# EAGLE design PygmyETEX_v1p00 (EAGLE 5.11)

## Sheet 1 of 5
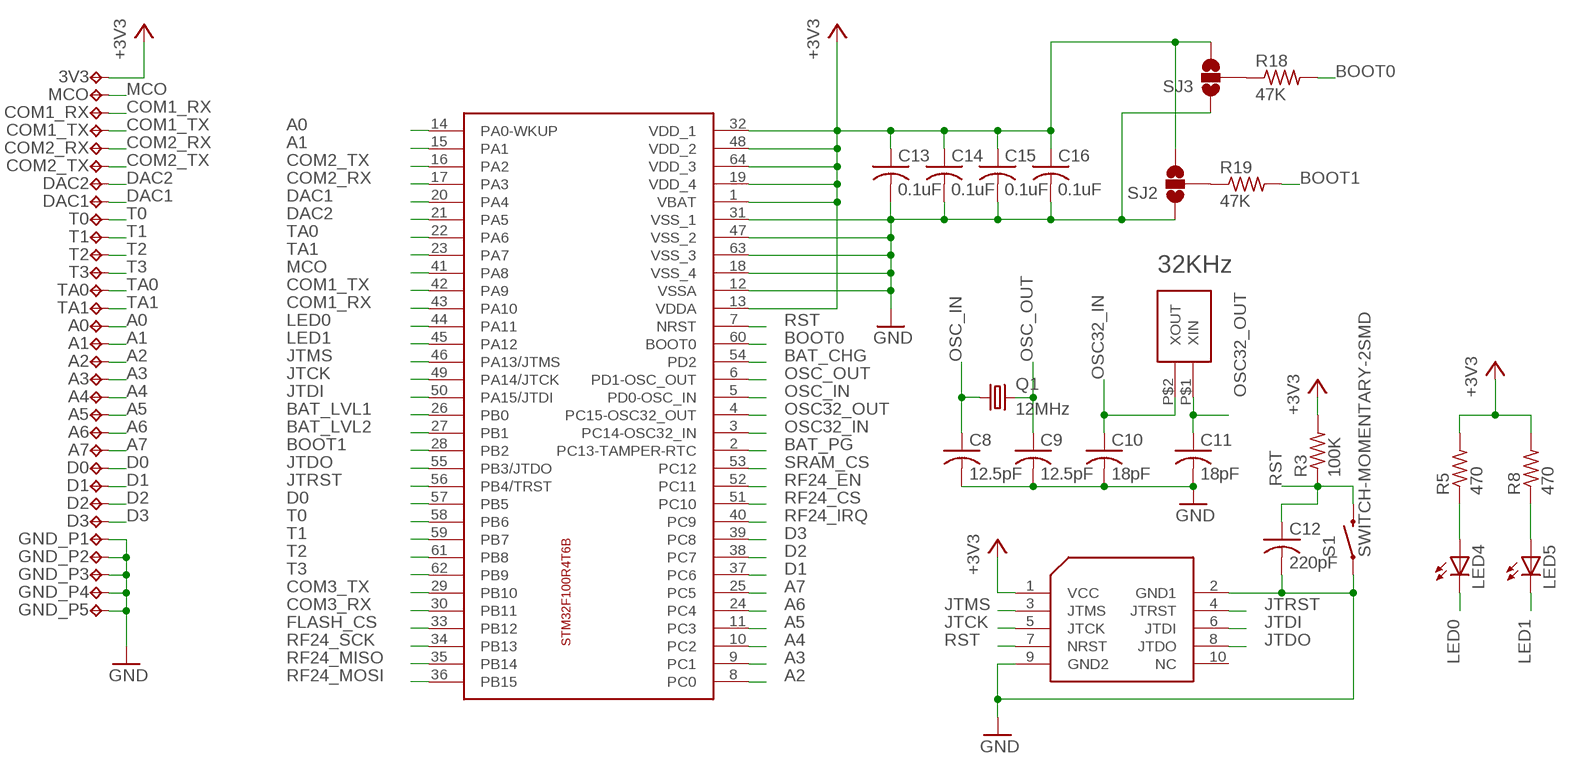
[diagram p0: schematic, sheet 1]

### Parts
3V3  TESTPAD_TPTESTPAD_PTH_STD  [TESTPAD_PTH_STD]
A0  TESTPAD_TPTESTPAD_PTH_STD  [TESTPAD_PTH_STD]
A1  TESTPAD_TPTESTPAD_PTH_STD  [TESTPAD_PTH_STD]
A2  TESTPAD_TPTESTPAD_PTH_STD  [TESTPAD_PTH_STD]
A3  TESTPAD_TPTESTPAD_PTH_STD  [TESTPAD_PTH_STD]
A4  TESTPAD_TPTESTPAD_PTH_STD  [TESTPAD_PTH_STD]
A5  TESTPAD_TPTESTPAD_PTH_STD  [TESTPAD_PTH_STD]
A6  TESTPAD_TPTESTPAD_PTH_STD  [TESTPAD_PTH_STD]
A7  TESTPAD_TPTESTPAD_PTH_STD  [TESTPAD_PTH_STD]
C8  12.5pF  C-USC0402  [C0402]
C9  12.5pF  C-USC0402  [C0402]
C10  18pF  C-USC0402  [C0402]
C11  18pF  C-USC0402  [C0402]
C12  220pF  C-USC0402  [C0402]
C13  0.1uF  C-USC0402  [C0402]
C14  0.1uF  C-USC0402  [C0402]
C15  0.1uF  C-USC0402  [C0402]
C16  0.1uF  C-USC0402  [C0402]
COM1_RX  TESTPAD_TPTESTPAD_PTH_STD  [TESTPAD_PTH_STD]
COM1_TX  TESTPAD_TPTESTPAD_PTH_STD  [TESTPAD_PTH_STD]
COM2_RX  TESTPAD_TPTESTPAD_PTH_STD  [TESTPAD_PTH_STD]
COM2_TX  TESTPAD_TPTESTPAD_PTH_STD  [TESTPAD_PTH_STD]
D0  TESTPAD_TPTESTPAD_PTH_STD  [TESTPAD_PTH_STD]
D1  TESTPAD_TPTESTPAD_PTH_STD  [TESTPAD_PTH_STD]
D2  TESTPAD_TPTESTPAD_PTH_STD  [TESTPAD_PTH_STD]
D3  TESTPAD_TPTESTPAD_PTH_STD  [TESTPAD_PTH_STD]
DAC1  TESTPAD_TPTESTPAD_PTH_STD  [TESTPAD_PTH_STD]
DAC2  TESTPAD_TPTESTPAD_PTH_STD  [TESTPAD_PTH_STD]
GND_P1  TESTPAD_TPTESTPAD_PTH_STD  [TESTPAD_PTH_STD]
GND_P2  TESTPAD_TPTESTPAD_PTH_STD  [TESTPAD_PTH_STD]
GND_P3  TESTPAD_TPTESTPAD_PTH_STD  [TESTPAD_PTH_STD]
GND_P4  TESTPAD_TPTESTPAD_PTH_STD  [TESTPAD_PTH_STD]
GND_P5  TESTPAD_TPTESTPAD_PTH_STD  [TESTPAD_PTH_STD]
LED4  LED0603  [LED-0603]
LED5  LED0603  [LED-0603]
MCO  TESTPAD_TPTESTPAD_PTH_STD  [TESTPAD_PTH_STD]
Q1  12MHz  CRYSTAL5X3  [CRYSTAL-SMD-5X3]
Q2  CM415  [CM415]
R3  100K  R-US_R0402  [R0402]
R5  470  R-US_R0402  [R0402]
R8  470  R-US_R0402  [R0402]
R18  47K  R-US_R0402  [R0402]
R19  47K  R-US_R0402  [R0402]
S1  SWITCH-MOMENTARY-2SMD  [TACTILE_SWITCH_SMD]
SJ2  SOLDERJUMPER_2WAYPASTE1&2  [SJ_3_PASTE1&2]
SJ3  SOLDERJUMPER_2WAYPASTE1&2  [SJ_3_PASTE1&2]
T0  TESTPAD_TPTESTPAD_PTH_STD  [TESTPAD_PTH_STD]
T1  TESTPAD_TPTESTPAD_PTH_STD  [TESTPAD_PTH_STD]
T2  TESTPAD_TPTESTPAD_PTH_STD  [TESTPAD_PTH_STD]
T3  TESTPAD_TPTESTPAD_PTH_STD  [TESTPAD_PTH_STD]
TA0  TESTPAD_TPTESTPAD_PTH_STD  [TESTPAD_PTH_STD]
TA1  TESTPAD_TPTESTPAD_PTH_STD  [TESTPAD_PTH_STD]
U3  STM32F100R4T6B  [S-PQFP64-G64]
U$1  STM32-JTAG-10P  [STM32-JTAG-10P]

### Nets
+3V3: 3V3.P$1(TP) C13.1 C14.1 C15.1 C16.1 R3.2 R5.2 R8.2 SJ2.3 SJ3.3 U3.1(VBAT) U3.13(VDDA) U3.19(VDD_4) U3.32(VDD_1) U3.48(VDD_2) U3.64(VDD_3) U$1.1(VCC) ; also sheet 2,3,5
A0: A0.P$1(TP) U3.14(PA0-WKUP)
A1: A1.P$1(TP) U3.15(PA1)
A2: A2.P$1(TP) U3.8(PC0)
A3: A3.P$1(TP) U3.9(PC1)
A4: A4.P$1(TP) U3.10(PC2)
A5: A5.P$1(TP) U3.11(PC3)
A6: A6.P$1(TP) U3.24(PC4)
A7: A7.P$1(TP) U3.25(PC5)
BAT_CHG: U3.54(PD2) ; also sheet 3
BAT_LVL1: U3.26(PB0) ; also sheet 3
BAT_LVL2: U3.27(PB1) ; also sheet 3
BAT_PG: U3.2(PC13-TAMPER-RTC) ; also sheet 3
BOOT0: R18.2 U3.60(BOOT0)
BOOT1: R19.2 U3.28(PB2)
COM1_RX: COM1_RX.P$1(TP) U3.43(PA10)
COM1_TX: COM1_TX.P$1(TP) U3.42(PA9)
COM2_RX: COM2_RX.P$1(TP) U3.17(PA3)
COM2_TX: COM2_TX.P$1(TP) U3.16(PA2)
COM3_RX: U3.30(PB11) ; also sheet 4
COM3_TX: U3.29(PB10) ; also sheet 4
D0: D0.P$1(TP) U3.57(PB5)
D1: D1.P$1(TP) U3.37(PC6)
D2: D2.P$1(TP) U3.38(PC7)
D3: D3.P$1(TP) U3.39(PC8)
DAC1: DAC1.P$1(TP) U3.20(PA4)
DAC2: DAC2.P$1(TP) U3.21(PA5)
FLASH_CS: U3.33(PB12) ; also sheet 5
GND: C8.2 C9.2 C10.2 C11.2 C12.2 C13.2 C14.2 C15.2 C16.2 GND_P1.P$1(TP) GND_P2.P$1(TP) GND_P3.P$1(TP) GND_P4.P$1(TP) GND_P5.P$1(TP) S1.1 SJ2.1 SJ3.1 U3.12(VSSA) U3.18(VSS_4) U3.31(VSS_1) U3.47(VSS_2) U3.63(VSS_3) U$1.2(GND1) U$1.9(GND2) ; also sheet 2,3,4,5
JTCK: U3.49(PA14/JTCK) U$1.5(JTCK)
JTDI: U3.50(PA15/JTDI) U$1.6(JTDI)
JTDO: U3.55(PB3/JTDO) U$1.8(JTDO)
JTMS: U3.46(PA13/JTMS) U$1.3(JTMS)
JTRST: U3.56(PB4/TRST) U$1.4(JTRST)
LED0: LED4.C U3.44(PA11)
LED1: LED5.C U3.45(PA12)
MCO: MCO.P$1(TP) U3.41(PA8)
N$23: LED4.A R5.1
N$29: LED5.A R8.1
N$31: R18.1 SJ3.2
N$33: R19.1 SJ2.2
OSC32_IN: C10.1 Q2.P$2(XOUT) U3.3(PC14-OSC32_IN)
OSC32_OUT: C11.1 Q2.P$1(XIN) U3.4(PC15-OSC32_OUT)
OSC_IN: C8.1 Q1.1 U3.5(PD0-OSC_IN)
OSC_OUT: C9.1 Q1.3 U3.6(PD1-OSC_OUT)
RF24_CS: U3.51(PC10) ; also sheet 2
RF24_EN: U3.52(PC11) ; also sheet 2
RF24_IRQ: U3.40(PC9) ; also sheet 2
RF24_MISO: U3.35(PB14) ; also sheet 2,5
RF24_MOSI: U3.36(PB15) ; also sheet 2,5
RF24_SCK: U3.34(PB13) ; also sheet 2,5
RST: C12.1 R3.1 S1.3 U3.7(NRST) U$1.7(NRST)
SRAM_CS: U3.53(PC12) ; also sheet 5
T0: T0.P$1(TP) U3.58(PB6)
T1: T1.P$1(TP) U3.59(PB7)
T2: T2.P$1(TP) U3.61(PB8)
T3: T3.P$1(TP) U3.62(PB9)
TA0: TA0.P$1(TP) U3.22(PA6)
TA1: TA1.P$1(TP) U3.23(PA7)
Unconnected: U$1.10(NC)

## Sheet 2 of 5
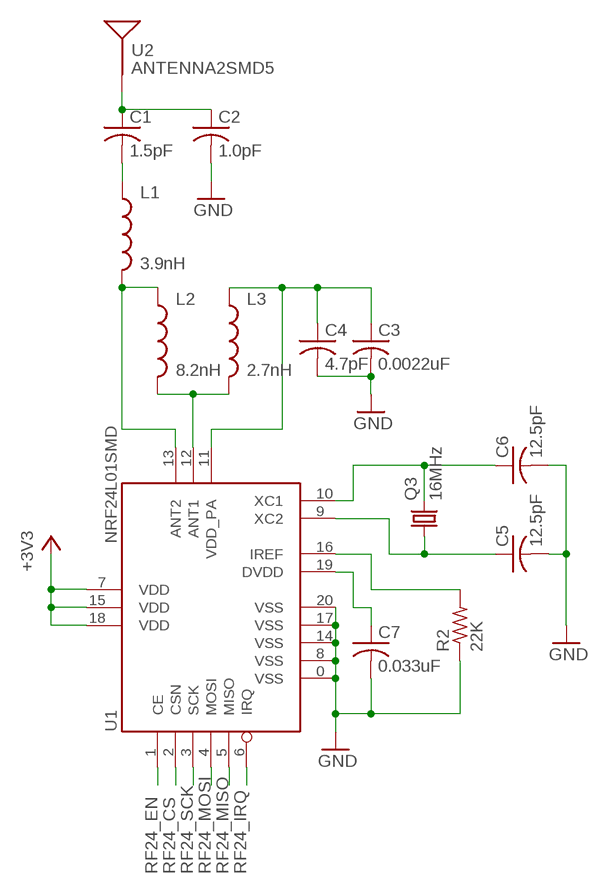
[diagram p1: schematic, sheet 2]

### Parts
C1  1.5pF  C-USC0402  [C0402]
C2  1.0pF  C-USC0402  [C0402]
C3  0.0022uF  C-USC0402  [C0402]
C4  4.7pF  C-USC0402  [C0402]
C5  12.5pF  C-USC0402  [C0402]
C6  12.5pF  C-USC0402  [C0402]
C7  0.033uF  C-USC0402  [C0402]
L1  3.9nH  INDUCTOR0402  [C0402]
L2  8.2nH  INDUCTOR0402  [C0402]
L3  2.7nH  INDUCTOR0402  [C0402]
Q3  16MHz  CRYSTAL5X3  [CRYSTAL-SMD-5X3]
R2  22K  R-US_R0402  [R0402]
U1  NRF24L01SMD  [QFN20]
U2  ANTENNA2SMD5  [ANTENNA-CHIP5]

### Nets
+3V3: U1.7(VDD) U1.15(VDD) U1.18(VDD) ; also sheet 1,3,5
GND: C2.2 C3.2 C4.2 C5.2 C6.2 C7.2 R2.1 U1.0(VSS) U1.8(VSS) U1.14(VSS) U1.17(VSS) U1.20(VSS) ; also sheet 1,3,4,5
N$1: C1.1 C2.1 U2.FEED(SIGNAL)
N$2: C1.2 L1.1
N$3: L1.2 L2.1 U1.13(ANT2)
N$4: L2.2 L3.2 U1.12(ANT1)
N$5: C3.1 C4.1 L3.1 U1.11(VDD_PA)
N$7: C6.1 Q3.3 U1.10(XC1)
N$8: C5.1 Q3.1 U1.9(XC2)
N$10: R2.2 U1.16(IREF)
N$11: C7.1 U1.19(DVDD)
RF24_CS: U1.2(CSN) ; also sheet 1
RF24_EN: U1.1(CE) ; also sheet 1
RF24_IRQ: U1.6(IRQ) ; also sheet 1
RF24_MISO: U1.5(MISO) ; also sheet 1,5
RF24_MOSI: U1.4(MOSI) ; also sheet 1,5
RF24_SCK: U1.3(SCK) ; also sheet 1,5

## Sheet 3 of 5
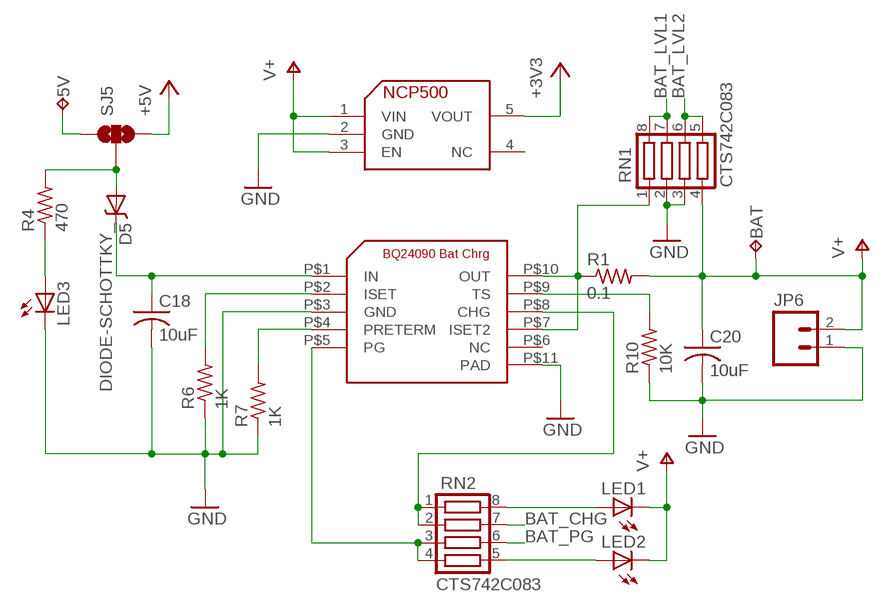
[diagram p2: schematic, sheet 3]

### Parts
5V  TESTPAD_TPTESTPAD_PTH_STD  [TESTPAD_PTH_STD]
BAT  TESTPAD_TPTESTPAD_PTH_STD  [TESTPAD_PTH_STD]
C18  10uF  C-USC1206  [C1206]
C20  10uF  C-USC1206  [C1206]
D5  DIODE-SCHOTTKY_  [SMA-DIODE]
JP6  M02-JST-2MM-SMT  [JST-2-SMD]
LED1  LED0603  [LED-0603]
LED2  LED0603  [LED-0603]
LED3  LED0603  [LED-0603]
R1  0.1  R-US_R0805  [R0805]
R4  470  R-US_R0402  [R0402]
R6  1K  R-US_R0402  [R0402]
R7  1K  R-US_R0402  [R0402]
R10  10K  R-US_R0402  [R0402]
RN1  CTS742C083  [CTS742C083]
RN2  CTS742C083  [CTS742C083]
SJ5  SOLDERJUMPER_2WAYPASTE1&2  [SJ_3_PASTE1&2]
U6  BQ24090  [R-PDSO-G10]
U8  NCP500  [SOT23-5L]

### Nets
+3V3: U8.5(VOUT) ; also sheet 1,2,5
+5V: SJ5.3 ; also sheet 4
BAT_CHG: RN2.7 ; also sheet 1
BAT_LVL1: RN1.7 RN1.8 ; also sheet 1
BAT_LVL2: RN1.5 RN1.6 ; also sheet 1
BAT_PG: RN2.6 ; also sheet 1
GND: C18.2 C20.2 JP6.1 LED3.C R6.1 R7.1 R10.1 RN1.2 RN1.3 U6.P$3(GND) U6.P$11(PAD) U8.2(GND) ; also sheet 1,2,4,5
N$6: C18.1 D5.C U6.P$1(IN)
N$9: 5V.P$1(TP) SJ5.1
N$12: R6.2 U6.P$2(ISET)
N$13: R7.2 U6.P$4(PRETERM)
N$14: RN2.3 RN2.4 U6.P$5(PG)
N$15: LED3.A R4.1
N$16: R1.1 RN1.1 U6.P$7(ISET2) U6.P$10(OUT)
N$17: RN2.1 RN2.2 U6.P$8(CHG)
N$18: R10.2 U6.P$9(TS)
N$20: LED1.A RN2.8
N$25: D5.A R4.2 SJ5.2
N$34: LED2.A RN2.5
V+: BAT.P$1(TP) C20.1 JP6.2 LED1.C LED2.C R1.2 RN1.4 U8.1(VIN) U8.3(EN)
Unconnected: U6.P$6(NC) U8.4(NC)

## Sheet 4 of 5
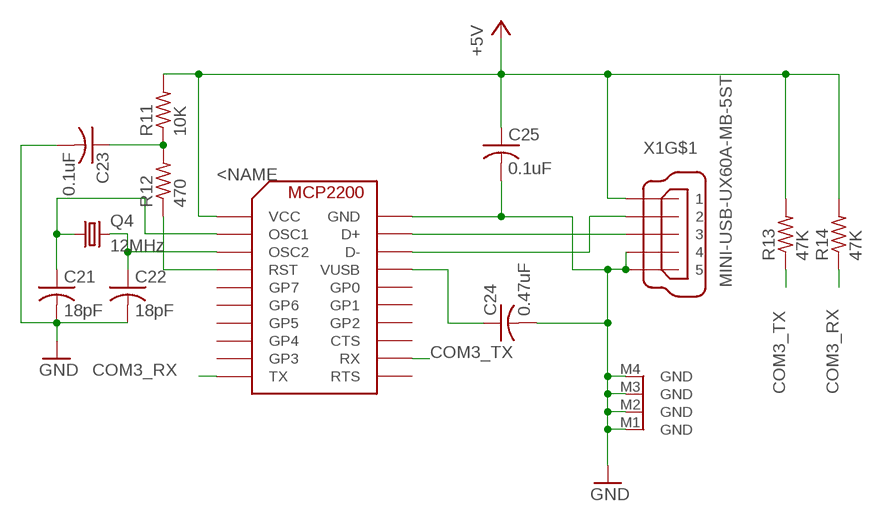
[diagram p3: schematic, sheet 4]

### Parts
C21  18pF  C-USC0402  [C0402]
C22  18pF  C-USC0402  [C0402]
C23  0.1uF  C-USC0402  [C0402]
C24  0.47uF  C-USC0402  [C0402]
C25  0.1uF  C-USC0402  [C0402]
Q4  12MHz  CRYSTAL5X3  [CRYSTAL-SMD-5X3]
R11  10K  R-US_R0402  [R0402]
R12  470  R-US_R0402  [R0402]
R13  47K  R-US_R0402  [R0402]
R14  47K  R-US_R0402  [R0402]
U7  MICROCHIP-USB-MCP2200  [QFN-20-5X5]
X1  MINI-USB-UX60A-MB-5ST  [UX60A-MB-5ST]

### Nets
+5V: C25.1 R11.2 R13.2 R14.2 U7.P18(VCC) X1.1 ; also sheet 3
COM3_RX: R14.1 U7.P7(TX) ; also sheet 1
COM3_TX: R13.1 U7.P9(RX) ; also sheet 1
GND: C21.2 C22.2 C23.2 C24.2 C25.2 U7.P17(GND) X1.4 X1.5 X1.M1(GND) X1.M2(GND) X1.M3(GND) X1.M4(GND) ; also sheet 1,2,3,5
N$19: C23.1 R11.1 R12.2
N$21: C22.1 Q4.3 U7.P20(OSC2)
N$22: C21.1 Q4.1 U7.P19(OSC1)
N$24: R12.1 U7.P1(RST)
N$26: U7.P15(D-) X1.2
N$28: C24.1 U7.P14(VUSB)
N$36: U7.P16(D+) X1.3
Unconnected: U7.P2(GP7) U7.P3(GP6) U7.P4(GP5) U7.P5(GP4) U7.P6(GP3) U7.P8(RTS) U7.P10(CTS) U7.P11(GP2) U7.P12(GP1) U7.P13(GP0)

## Sheet 5 of 5
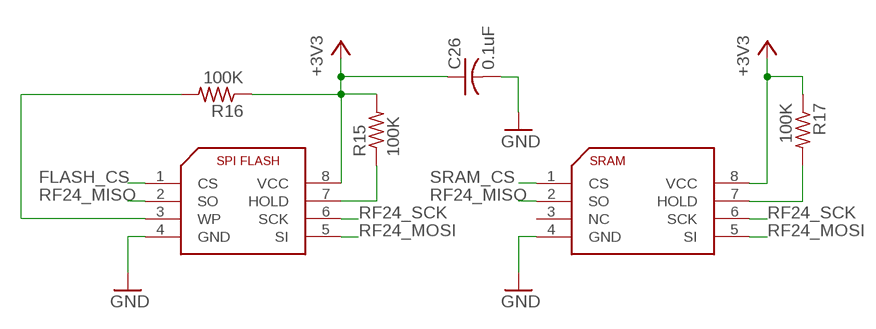
[diagram p4: schematic, sheet 5]

### Parts
C26  0.1uF  C-USC0402  [C0402]
R15  100K  R-US_R0402  [R0402]
R16  100K  R-US_R0402  [R0402]
R17  100K  R-US_R0402  [R0402]
U9  SST25VF080B  [SOIC8]
U10  N25S0830HA  [TSSOP8]

### Nets
+3V3: C26.1 R15.2 R16.1 R17.1 U9.8(VCC) U10.8(VCC) ; also sheet 1,2,3
FLASH_CS: U9.1(CS) ; also sheet 1
GND: C26.2 U9.4(GND) U10.4(GND) ; also sheet 1,2,3,4
N$27: R17.2 U10.7(HOLD)
N$30: R16.2 U9.3(WP)
N$32: R15.1 U9.7(HOLD)
RF24_MISO: U9.2(SO) U10.2(SO) ; also sheet 1,2
RF24_MOSI: U9.5(SI) U10.5(SI) ; also sheet 1,2
RF24_SCK: U9.6(SCK) U10.6(SCK) ; also sheet 1,2
SRAM_CS: U10.1(CS) ; also sheet 1
Unconnected: U10.3(NC)

## Library data of the parts
3V3 5V A0 A1-A7 BAT COM1_RX COM1_TX COM2_RX COM2_TX D0 D1-D3 DAC1 DAC2 GND_P1-GND_P5 MCO T0 T1-T3 TA0 TA1 = Pygmy:TESTPAD_TP: Test pad
C1-C16 C18 C20-C26 = rcl:C-US: CAPACITOR, American symbol
D5 = SparkFun:DIODE-SCHOTTKY
JP6 = SparkFun:M02: Header 2 Standard 2-pin 0.1" header. Use with straight break away headers (SKU : PRT-00116), right angle break away headers (PRT-00553), swiss pins (PRT-00743), machine pins (PRT-00117), and female headers (PRT-00115). Molex polarized connector foot print use with SKU : PRT-08233 with associated crimp pins and housings.
L1-L3 = SparkFun:INDUCTOR: Inductors Basic Inductor/Choke - 0603 and 1206. Footprints are not proven and vary greatly between part numbers.
LED1-LED5 = SparkFun:LED: LEDs Standard schematic elements and footprints for 5mm, 3mm, 1206, and 0603 sized LEDs. 5mm - Spark Fun Electronics SKU : COM-00529 (and others)
Q1 Q3 Q4 = SparkFun:CRYSTAL: Crystals Various standard crystals. Proven footprints. Spark Fun Electronics SKU : COM-00534
Q2 = dublib:CM415
R1-R8 R10-R19 = rcl:R-US_: RESISTOR, American symbol
RN1 RN2 = resistor-net:CTS742C083: Chip Resistor Array 4 Single Resistor Source: http://www.ctscorp.com/components/Datasheets/CTSChipArrayDs.pdf; OC_FARNELL: unknown; OC_NEWARK: unknown
S1 = SparkFun:SWITCH-MOMENTARY-2
SJ2 SJ3 = SparkFun:SOLDERJUMPER_2WAY: Solder Jumper 2 way solder jumper
SJ5 = Pygmy:SOLDERJUMPER_2WAY: Solder Jumper 2 way solder jumper
U1 = SparkFun:NRF24L01: 2.4GHz Low Power Transceiver This is the very popular, low cost, very low power RF transceiver from Nordic Semiconductor. Simple SPI interface. SKU: COM-00690
U2 = SparkFun:ANTENNA2: Antenna Single endded antenna. Common with smaller chip antennas. CHIP4 package is the GPS Chip Antenna SKU: GPS-08418. CHIP5 package is 2.4GHz chip antenna SKU: WRL-00144.
U3 = dublib:STM32F100R4T6B
U6 = dublib:BQ24090
U7 = dublib:MICROCHIP-USB-MCP2200
U8 = dublib:NCP500
U9 = dublib:SST25VF080B
U10 = dublib:N25S0830HA
U$1 = Pygmy:STM32-JTAG-10P
X1 = dublib:MINI-USB-: MINI USB Connector Source: http://www.hirose.co.jp/cataloge_hp/e24000019.pdf

## Board
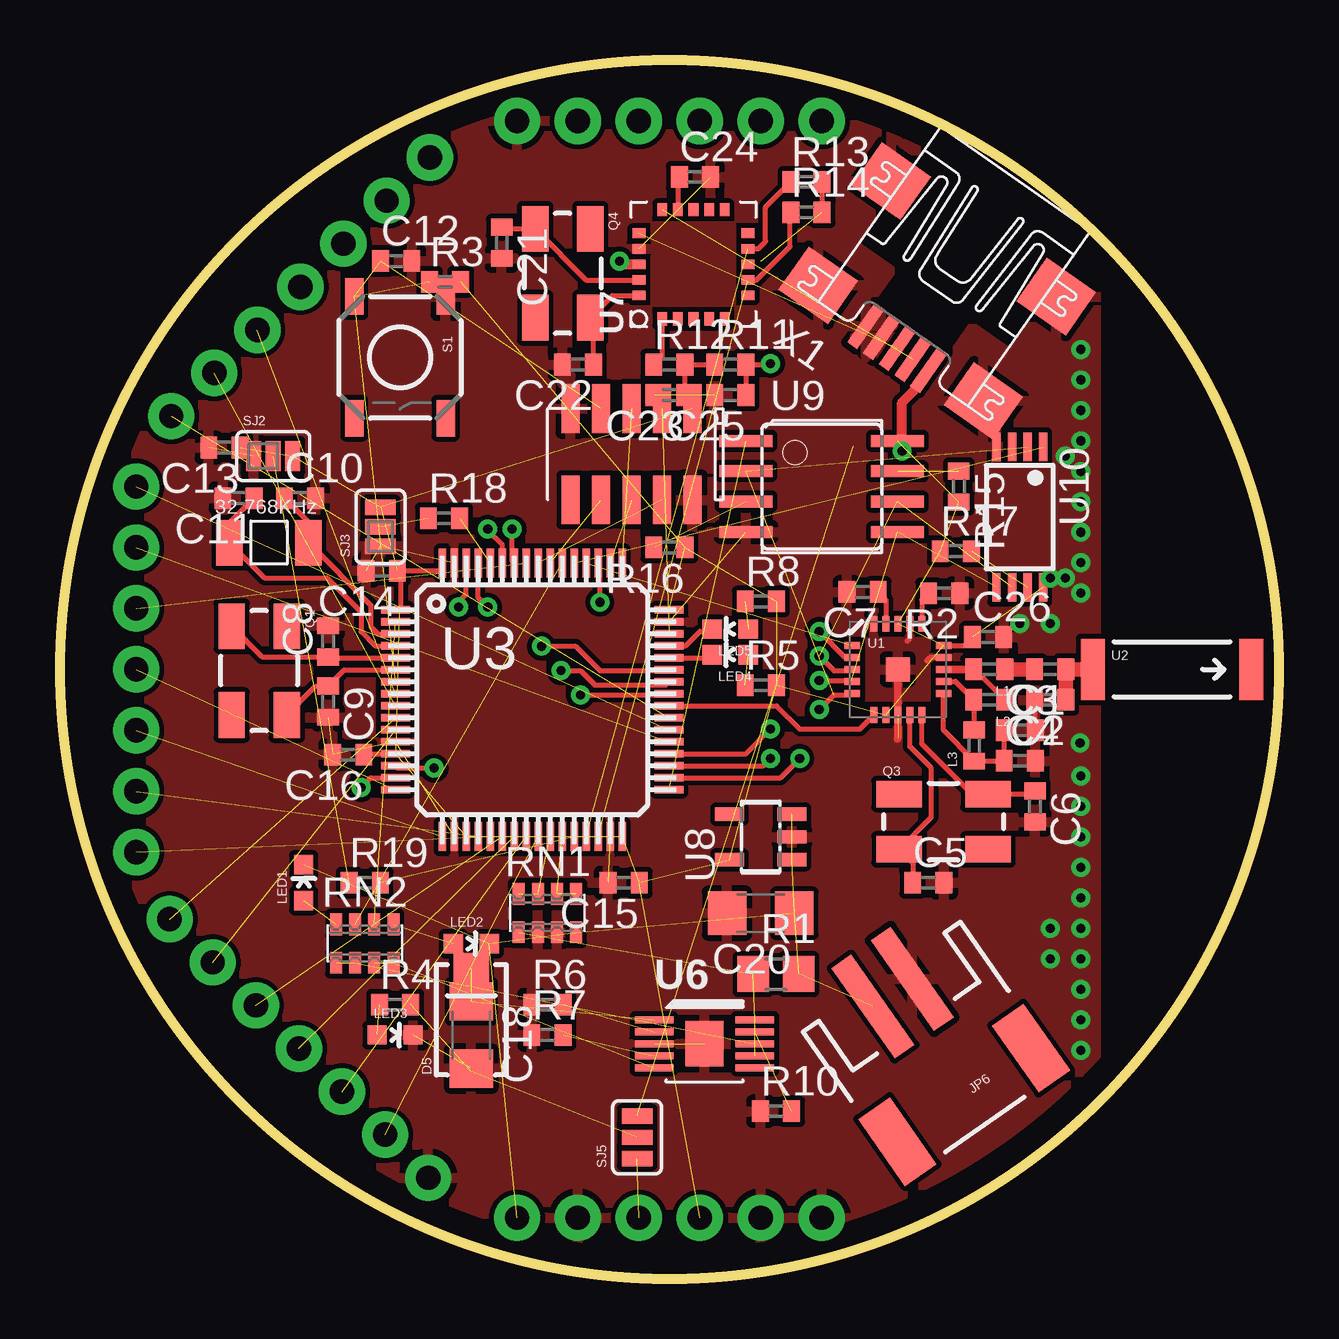
[diagram p5: board, top side]
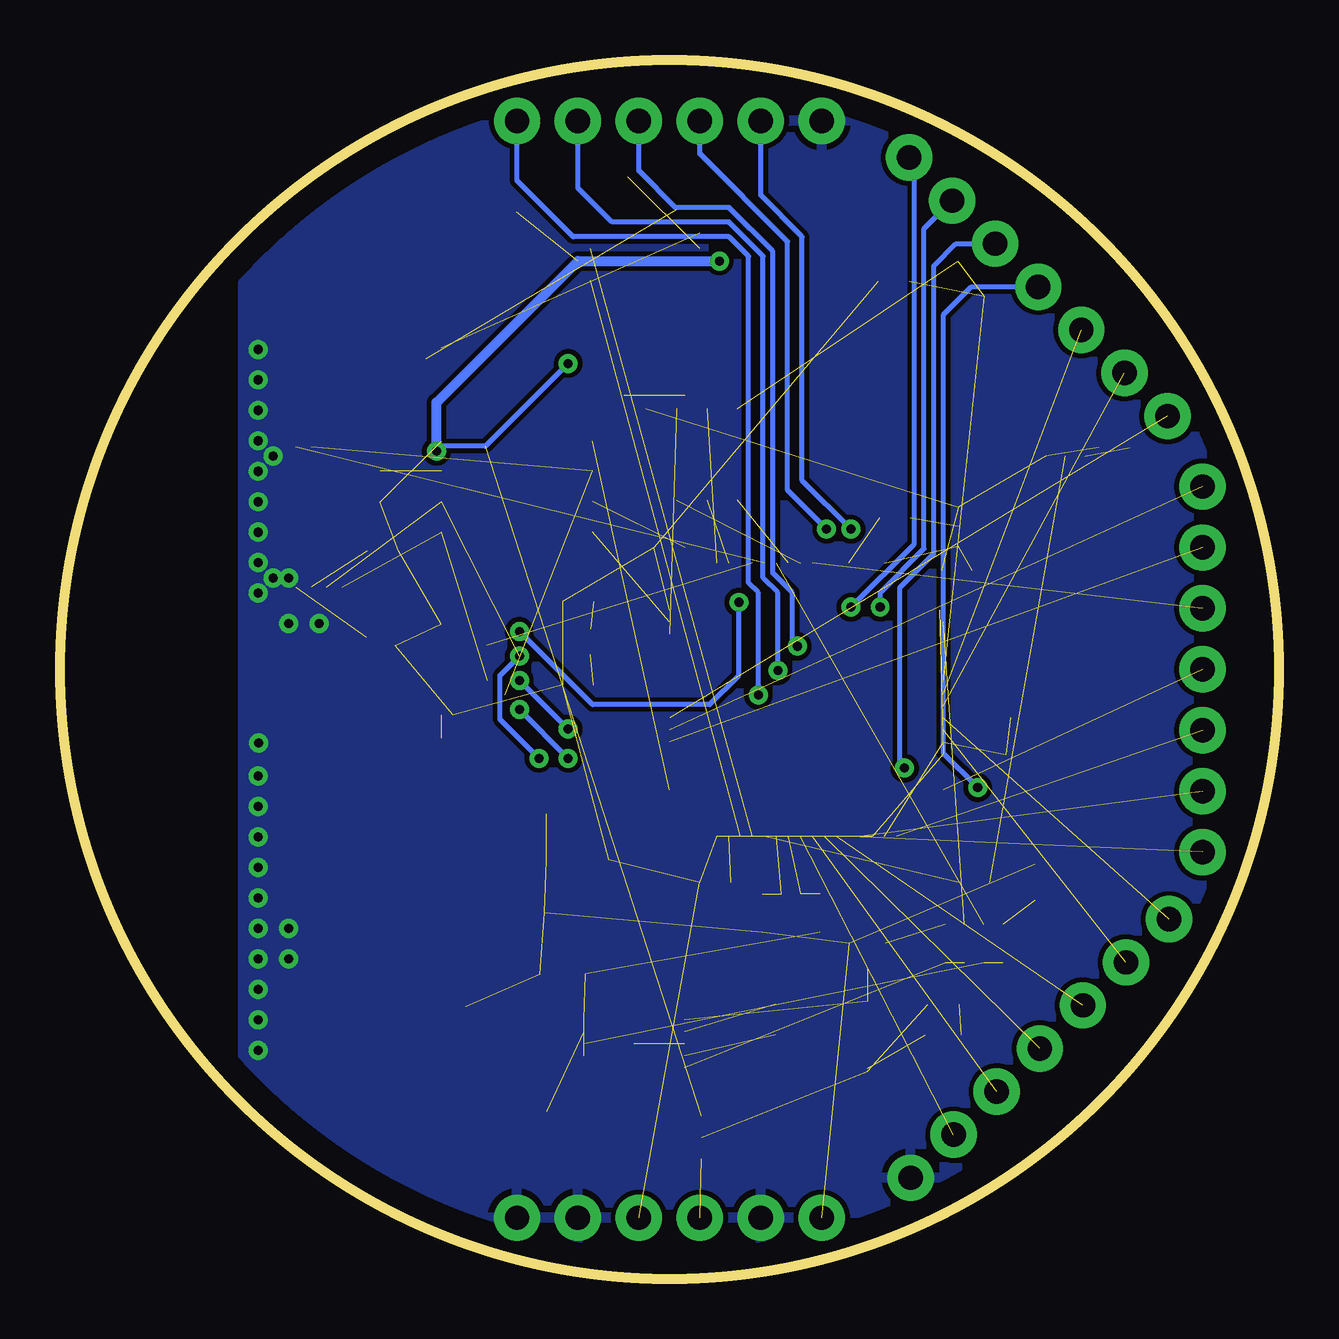
[diagram p6: board, bottom side, seen from below]

Size 50.8 x 50.8 mm. Coordinates in mm from the lower left corner, seen from the top.
Outline: circle at 25.4,25.4 radius 25.4
Copper layers (1*16): Top 0.035mm / dielectric 1.5mm / Bottom 0.035mm
Design rules "default": minimum track width 10mil, minimum drill 24mil, track to track 8mil, track to pad 8mil, pad to pad 8mil, via to via 8mil, smd to smd 8mil, copper to edge 40mil, drill to drill 8mil, minimum pad ring 10mil, minimum via ring 8mil, stop-mask expansion 4mil, vias tented up to drill 0mil, thermal gap 10mil

### Footprints (pad centres in the part's own frame; a part is rotated, then mirrored left to right if it is on the bottom)
TESTPAD_PTH_STD = drill 1.016 pad 1.93 round: P$1 0,0
C0402 = smd 0.7 x 0.9: 1 -0.65,0; 2 0.65,0
C1206 = smd 1.6 x 1.8: 1 -1.4,0; 2 1.4,0
SMA-DIODE = smd 1.27 x 1.47: A -2.15,0; C 2.15,0
JST-2-SMD = smd 1 x 4.6: 1 -1,-3.7; 2 1,-3.7 | smd 1.6 x 3.4: NC1 -3.4,1.5; NC2 3.4,1.5
LED-0603 = smd 0.8 x 0.8: A 0,-0.75; C 0,0.75
CRYSTAL-SMD-5X3 = smd 1.9 x 1.1: 1 -1.85,-1.15; 2 1.85,-1.15; 3 1.85,1.15; 4 -1.85,1.15
CM415 = smd 1.1 x 1.9: P$1 0,0; P$2 3.3,0
R0805 = smd 1.3 x 1.5: 1 -0.95,0; 2 0.95,0
R0402 = smd 0.7 x 0.9: 1 -0.65,0; 2 0.65,0
CTS742C083 = smd 0.5 x 0.9: 1 -1.2,-0.8; 2 -0.4,-0.8; 3 0.4,-0.8; 4 1.2,-0.8; 5 1.2,0.8; 6 0.4,0.8; 7 -0.4,0.8; 8 -1.2,0.8
TACTILE_SWITCH_SMD = smd 1.524 x 0.762: 1 -2.54,1.905; 2 2.54,1.905; 3 -2.54,-1.905; 4 2.54,-1.905
SJ_3_PASTE1&2 = smd 0.635 x 1.27: 1 -0.813,0; 2 0,0; 3 0.813,0
SJ_3_PASTE1&2' = smd 0.635 x 1.27: 1 -0.889,0; 2 0,0; 3 0.889,0
QFN20 = smd 1 x 1: 0 0,0 | smd 0.65 x 0.3: 1 -1.9,1; 2 -1.9,0.5; 3 -1.9,0; 4 -1.9,-0.5; 5 -1.9,-1; 11 1.9,-1; 12 1.9,-0.5; 13 1.9,0; 14 1.9,0.5; 15 1.9,1 | smd 0.3 x 0.65: 6 -1,-1.9; 7 -0.5,-1.9; 8 0,-1.9; 9 0.5,-1.9; 10 1,-1.9; 16 1,1.9; 17 0.5,1.9; 18 0,1.9; 19 -0.5,1.9; 20 -1,1.9
ANTENNA-CHIP5 = smd 1.016 x 2.54: FEED -3.302,0; NC 3.302,0
S-PQFP64-G64 = smd 1.2 x 0.3: 1 -5.7,3.75; 2 -5.7,3.25; 3 -5.7,2.75; 4 -5.7,2.25; 5 -5.7,1.75; 6 -5.7,1.25; 7 -5.7,0.75; 8 -5.7,0.25; 9 -5.7,-0.25; 10 -5.7,-0.75; 11 -5.7,-1.25; 12 -5.7,-1.75; 13 -5.7,-2.25; 14 -5.7,-2.75; 15 -5.7,-3.25; 16 -5.7,-3.75; 33 5.7,-3.75; 34 5.7,-3.25; 35 5.7,-2.75; 36 5.7,-2.25; 37 5.7,-1.75; 38 5.7,-1.25; 39 5.7,-0.75; 40 5.7,-0.25; 41 5.7,0.25; 42 5.7,0.75; 43 5.7,1.25; 44 5.7,1.75; 45 5.7,2.25; 46 5.7,2.75; 47 5.7,3.25; 48 5.7,3.75 | smd 0.3 x 1.2: 17 -3.75,-5.7; 18 -3.25,-5.7; 19 -2.75,-5.7; 20 -2.25,-5.7; 21 -1.75,-5.7; 22 -1.25,-5.7; 23 -0.75,-5.7; 24 -0.25,-5.7; 25 0.25,-5.7; 26 0.75,-5.7; 27 1.25,-5.7; 28 1.75,-5.7; 29 2.25,-5.7; 30 2.75,-5.7; 31 3.25,-5.7; 32 3.75,-5.7; 49 3.75,5.7; 50 3.25,5.7; 51 2.75,5.7; 52 2.25,5.7; 53 1.75,5.7; 54 1.25,5.7; 55 0.75,5.7; 56 0.25,5.7; 57 -0.25,5.7; 58 -0.75,5.7; 59 -1.25,5.7; 60 -1.75,5.7; 61 -2.25,5.7; 62 -2.75,5.7; 63 -3.25,5.7; 64 -3.75,5.7
R-PDSO-G10 = smd 0.3 x 1.6: P$1 0,0; P$2 0.5,0; P$3 1,0; P$4 1.5,0; P$5 2,0; P$6 2,4.2; P$7 1.5,4.2; P$8 1,4.2; P$9 0.5,4.2; P$10 0,4.2 | smd 1.9 x 1.6: P$11 1,2.1
QFN-20-5X5 = smd 0.55 x 0.4: P1 0,-0.975; P2 0,-1.625; P3 0,-2.275; P4 0,-2.925; P5 0,-3.575; P11 4.55,-3.575; P12 4.55,-2.925; P13 4.55,-2.275; P14 4.55,-1.625; P15 4.55,-0.975 | smd 0.4 x 0.55: P6 0.975,-4.55; P7 1.625,-4.55; P8 2.275,-4.55; P9 2.925,-4.55; P10 3.575,-4.55; P16 3.575,0; P17 2.925,0; P18 2.275,0; P19 1.625,0; P20 0.975,0
SOT23-5L = smd 0.55 x 1.2: 1 -0.95,-1.3; 2 0,-1.3; 3 0.95,-1.3; 4 0.95,1.3; 5 -0.95,1.3
SOIC8@1 = smd 0.5 x 2.2: 1 -1.905,-3.154; 2 -0.645,-3.154; 3 0.625,-3.154; 4 1.895,-3.154; 5 1.905,3.154; 6 0.635,3.154; 7 -0.635,3.154; 8 -1.905,3.154
TSSOP8 = smd 1.2 x 0.35: 1 -2.925,0.975; 2 -2.925,0.325; 3 -2.925,-0.325; 4 -2.925,-0.975; 5 2.925,-0.975; 6 2.925,-0.325; 7 2.925,0.325; 8 2.925,0.975
STM32-JTAG-10P = smd 0.762 x 2.032: 1 0,0; 2 0,3.81; 3 1.27,0; 4 1.27,3.81; 5 2.54,0; 6 2.54,3.81; 7 3.81,0; 8 3.81,3.81; 9 5.08,0; 10 5.08,3.81
UX60A-MB-5ST = smd 2 x 0.5: 1 2.25,1.6; 2 2.25,0.8; 3 2.25,0; 4 2.25,-0.8; 5 2.25,-1.6 | smd 2.2 x 2.5: M1 -3.3,-4.2; M2 -3.3,4.2; M3 2,4.2; M4 2,-4.2

### Placement (x,y rotation side)
3V3  26.67,2.54 0 top
5V  24.13,2.54 0 top
A0  11.82,43.14 270 top
A1  10.02,41.35 270 top
A2  8.23,39.55 270 top
A3  6.43,37.75 270 top
A4  4.57,14.98 135 top
A5  6.37,13.19 135 top
A6  11.75,7.8 135 top
A7  13.55,6 135 top
BAT  19.05,2.54 0 top
C1  41.27,25.4 180 top
C2  41.27,24.13 180 top
C3  40,22.86 0 top
C4  40,21.59 0 top
C5  36.2,16.51 0 top
C6  40.64,19.68 270 top
C7  33.45,28.63 180 top
C8  11.18,26.57 90 top
C9  11.18,24.05 270 top
C10  10.01,32.54 0 top
C11  7.44,32.54 180 top
C12  14.02,42.42 0 top
C13  6.86,34.65 180 top
C14  13.41,29.51 180 top
C15  23.49,16.51 180 top
C16  12.01,21.84 180 top
C18  17.14,10.16 270 top
C20  29.21,15.24 180 top
C21  18.41,43.18 270 top
C22  21.59,38.1 180 top
C23  25.4,36.83 180 top
C24  26.47,45.92 0 top
C25  27.94,36.83 180 top
C26  38.68,26.75 0 top
COM1_RX  26.67,48.26 0 top
COM1_TX  29.21,48.26 0 top
COM2_RX  3.17,22.86 0 top
COM2_TX  3.17,25.4 0 top
D0  3.17,27.94 0 top
D1  3.17,30.48 0 top
D2  3.17,33.02 0 top
D3  4.63,35.96 270 top
D5  17.14,10.79 90 top
DAC1  3.17,20.32 0 top
DAC2  3.17,17.78 0 top
GND_P1  31.75,2.54 0 top
GND_P2  29.21,2.54 0 top
GND_P3  19.05,48.26 0 top
GND_P4  15.35,4.21 90 top
GND_P5  21.59,2.54 0 top
JP6  36.83,8.89 215 top
L1  38.73,25.4 180 top
L2  38.73,24.13 180 top
L3  38.1,22.22 90 top
LED1  10.16,16.51 0 top
LED2  17.14,13.97 270 top
LED3  13.97,10.16 270 top
LED4  27.94,26.01 90 top
LED5  27.94,27.08 90 top
MCO  31.75,48.26 0 top
Q1  8.31,25.35 270 top
Q2  7.06,30.68 0 top
Q3  36.83,19.05 0 top
Q4  20.95,41.91 270 top
R1  29.84,12.7 0 top
R2  36.86,28.57 180 top
R3  16.05,41.55 0 top
R4  13.97,11.43 0 top
R5  29.21,24.74 0 top
R6  20.32,11.43 0 top
R7  20.32,10.16 0 top
R8  29.21,28.23 0 top
R10  29.84,6.98 0 top
R11  27.94,38.1 0 top
R12  25.4,38.1 0 top
R13  31.12,45.72 0 top
R14  31.12,44.45 0 top
R15  37.46,33.02 270 top
R16  25.4,30.48 180 top
R17  37.34,30.33 0 top
R18  16,31.7 0 top
R19  12.7,16.51 0 top
RN1  20.32,15.24 0 top
RN2  12.7,13.97 0 top
S1  14.17,38.4 270 top
SJ2  8.89,34.29 0 top
SJ3  13.36,31.34 90 top
SJ5  [SJ_3_PASTE1&2']  24.05,5.89 90 top
T0  24.13,48.26 0 top
T1  21.59,48.26 0 top
T2  15.41,46.73 270 top
T3  13.61,44.94 270 top
TA0  8.16,11.39 135 top
TA1  9.96,9.6 135 top
U1  34.92,25.4 0 top
U2  46.35,25.4 0 top
U3  19.68,24.13 0 top
U6  24.76,10.79 270 top
U7  24.13,40 90 top
U8  29.21,18.41 90 top
U9  SST25VF080B  [SOIC8@1]  31.75,33.02 270 top
U10  40,31.75 270 top
U$1  26.37,36.27 180 top
X1  36.2,40.64 235 top

### Tracks (layer width: path | path; a pad name or v marks a point on that pad's centre or on a via)
+3V3  (22 unrouted)
  Top 0.203: U1.15 37.69,26.4 C26.1 | U3.13 12.7,21.88 C16.1 | U3.1 14.14,27.88 14.22,27.96 14.22,29.47 C14.1 15.9,29.52 15.93,29.55 U3.64
+5V  (via drill 0.38)  (2 unrouted)
  Top 0.203: R13.2 R14.2 | 35.92,37.34 35.92,37.58 X1.1 | C25.1 R11.2 29.57,38.1 v29.62,38.15
  Top 0.406: U7.P18 23.45,42.28 v23.32,42.42 | v35.1,34.49 35.1,36.52 35.92,37.34
  Bottom 0.203: v29.62,38.15 33.07,34.7 34.9,34.7 v35.1,34.49
  Bottom 0.406: v23.32,42.42 29.21,42.42 35.1,36.52 v35.1,34.49
A0  (via drill 0.38)
  Top 0.203: v15.6,21.29 14.08,21.29 U3.14
  Bottom 0.203: A0.P$1 13.45,43.14 14.38,42.21 14.38,30.23 15.8,28.8 15.8,21.49 v15.6,21.29
A1  (via drill 0.38)
  Top 0.203: v12.55,20.47 12.95,20.88 U3.15
  Bottom 0.203: A1.P$1 12.81,41.34 13.97,40.18 13.97,21.89 v12.55,20.47
A2  (1 unrouted)
A3  (1 unrouted)
A4  (1 unrouted)
A5  (1 unrouted)
A6  (1 unrouted)
A7  (1 unrouted)
BAT_CHG  (1 unrouted)
BAT_LVL1  (2 unrouted)
BAT_LVL2  (2 unrouted)
BAT_PG  (1 unrouted)
BOOT0  (1 unrouted)
BOOT1  (1 unrouted)
COM1_RX  (via drill 0.38)
  Top 0.203: v20.07,26.37 21.49,26.37 22.5,25.35 25.35,25.35 U3.43
  Bottom 0.203: COM1_RX.P$1 26.67,46.18 25.15,44.65 22.91,44.65 21.08,42.82 21.08,29.41 20.27,28.6 20.27,26.57 v20.07,26.37
COM1_TX  (via drill 0.38)
  Top 0.203: v20.88,25.35 21.69,25.35 22.3,24.74 25.24,24.74 U3.42
  Bottom 0.203: COM1_TX.P$1 29.21,45.47 27.79,44.04 22.91,44.04 21.49,42.62 21.49,29.21 20.88,28.6 v20.88,25.35
COM2_RX  (1 unrouted)
COM2_TX  (1 unrouted)
COM3_RX  (1 unrouted)
  Top 0.203: U7.P7 29.03,41.63 30.43,43.03 30.43,44.41 R14.1
COM3_TX  (1 unrouted)
  Top 0.203: U7.P9 29.11,42.93 29.41,43.23 29.41,44.67 R13.1
D0  (1 unrouted)
D1  (1 unrouted)
D2  (1 unrouted)
D3  (1 unrouted)
DAC1  (1 unrouted)
DAC2  (1 unrouted)
FLASH_CS  (1 unrouted)
GND  (via drill 0.38)  (13 unrouted)
  Top 0.203: C3.2 40.66,24.1 C2.2 | U1.17 35.42,26.69 35.31,26.57 | U1.14 36.26,25.9 36.12,25.76
  Top 0.305: U1.0 34.92,22.53 34.9,22.5
  other vias: 42.55,29.84 41.27,27.3 42.55,36.2 42.55,28.57 42.55,37.46 42.55,34.92 42.55,33.66 41.91,34.29 42.55,32.38 42.55,38.73 42.55,31.12 41.91,29.21 41.27,29.21 40,27.3 42.52,22.33 42.55,20.95 42.55,19.68 42.55,18.41 42.55,17.14 42.55,15.88 42.55,14.6 41.27,14.6 42.55,10.79 42.55,12.06 42.55,13.33 42.55,9.52 41.27,13.33
  pour Top: -7.62,59.69 43.18,59.69 43.18,-8.89 -7.62,-8.89
  pour Bottom: -7.62,59.69 43.18,59.69 43.18,-8.89 -7.62,-8.89
JTCK  (1 unrouted)
JTDI  (1 unrouted)
JTDO  (1 unrouted)
JTMS  (1 unrouted)
JTRST  (1 unrouted)
LED0
  Top 0.203: U3.44 27.06,25.88 LED4.C
LED1
  Top 0.203: U3.45 26.06,26.38 26.67,26.99 27.1,26.99 LED5.C
MCO  (via drill 0.38)
  Top 0.203: v21.69,24.33 25.34,24.33 U3.41
  Bottom 0.203: MCO.P$1 31.75,45.77 29.41,43.43 22.91,43.43 22.1,42.62 22.1,29.01 21.69,28.6 v21.69,24.33
N$1
  Top 0.61: U2.FEED C1.1 C2.1
N$2
  Top 0.61: L1.1 C1.2
N$3
  Top 0.203: L1.2 38.09,25.43 L2.1
  Top 0.305: U1.13 L1.2
N$4
  Top 0.203: U1.12 37.33,24.9 L2.2 L3.2
N$5
  Top 0.203: C3.1 C4.1 39.34,21.57 L3.1 36.82,22.86 U1.11
N$6  (2 unrouted)
N$7
  Top 0.203: U1.10 35.92,22.29 37.95,20.27 38.61,20.27 Q3.3 40.5,20.2 C6.1
N$8
  Top 0.203: U1.9 35.42,22.18 36.32,21.29 36.32,19.24 Q3.1 35.55,17.33 C5.1
N$9  (1 unrouted)
N$10
  Top 0.203: U1.16 35.92,28.3 R2.2
N$11
  Top 0.203: U1.19 34.42,28.3 C7.1
N$12  (1 unrouted)
N$13  (1 unrouted)
N$14  (2 unrouted)
N$15  (1 unrouted)
N$16  (3 unrouted)
N$17  (2 unrouted)
N$18  (1 unrouted)
N$19
  Top 0.203: R11.1 R12.2 C23.1
N$20  (1 unrouted)
N$21
  Top 0.203: U7.P20 23.02,40.98 Q4.3 22.24,39.92 C22.1
N$22
  Top 0.203: U7.P19 21.93,41.63 Q4.1 18.48,43.76 C21.1
N$23  (1 unrouted)
N$24
  Top 0.203: U7.P1 25.1,38.45 R12.1
N$25  (2 unrouted)
N$26  (1 unrouted)
N$27  (1 unrouted)
N$28
  Top 0.203: U7.P14 25.75,45.86 C24.1
N$29  (1 unrouted)
N$30  (1 unrouted)
N$31  (1 unrouted)
N$32  (1 unrouted)
N$33  (1 unrouted)
N$34  (1 unrouted)
N$36  (1 unrouted)
OSC32_IN
  Top 0.203: U3.3 13.25,26.88 12.95,27.18 12.95,28.09 Q2.P$2 10.36,31.53 C10.1
OSC32_OUT
  Top 0.203: U3.4 13.14,26.38 12.55,26.98 12.55,27.79 11.12,29.21 8.53,29.21 Q2.P$1 7.06,31.51 C11.1
OSC_IN
  Top 0.203: U3.5 11.21,25.88 C8.1 8.44,25.92 Q1.1
OSC_OUT
  Top 0.203: U3.6 11.85,25.38 C9.1 10.66,24.7 Q1.3
RF24_CS  (via drill 0.38)
  Top 0.203: U1.2 32.72,25.9 v31.65,26.98 | v22.5,28.19 22.5,29.76 U3.51
  Bottom 0.203: v31.65,26.98 28.6,23.93 23.72,23.93 22.5,25.15 v22.5,28.19
RF24_EN  (1 unrouted)
RF24_IRQ
  Top 0.203: U3.40 29.87,23.88 30.84,22.91 33.34,22.91 U1.6
RF24_MISO  (via drill 0.38)  (2 unrouted)
  Top 0.203: U3.35 29.3,21.38 v29.62,21.69 | v31.65,23.72 32.26,24.33 32.96,24.33 U1.5
  Bottom 0.203: v29.62,21.69 v31.65,23.72
RF24_MOSI  (via drill 0.38)  (2 unrouted)
  Top 0.203: U3.36 28.59,21.88 v29.62,22.91 | v31.65,24.94 32.98,24.94 U1.4
  Bottom 0.203: v29.62,22.91 v31.65,24.94
RF24_SCK  (via drill 0.38)  (2 unrouted)
  Top 0.203: U3.34 30.02,20.88 v30.84,21.69 | v31.65,25.96 32.26,25.35 32.97,25.35 U1.3
  Bottom 0.203: v30.84,21.69 32.46,23.32 32.46,25.15 v31.65,25.96
RST  (4 unrouted)
SRAM_CS  (1 unrouted)
T0  (via drill 0.38)
  Top 0.203: v18.85,31.24 18.85,29.92 U3.58
  Bottom 0.203: T0.P$1 24.13,46.89 20.47,43.23 20.47,32.87 v18.85,31.24
T1  (via drill 0.38)
  Top 0.203: v17.83,31.24 17.83,31.19 18.44,30.58 U3.59
  Bottom 0.203: T1.P$1 21.59,45.16 19.86,43.43 19.86,33.27 v17.83,31.24
T2  (via drill 0.38)
  Top 0.203: U3.61 17.43,28.39 v17.83,27.99
  Bottom 0.203: v17.83,27.99 15.19,30.63 15.19,46.51 T2.P$1
T3  (via drill 0.38)
  Top 0.203: U3.62 16.93,28.52 16.61,28.19 v16.61,27.99
  Bottom 0.203: v16.61,27.99 16.61,28.6 14.78,30.43 14.78,43.77 T3.P$1
TA0  (1 unrouted)
TA1  (1 unrouted)
V+  (8 unrouted)